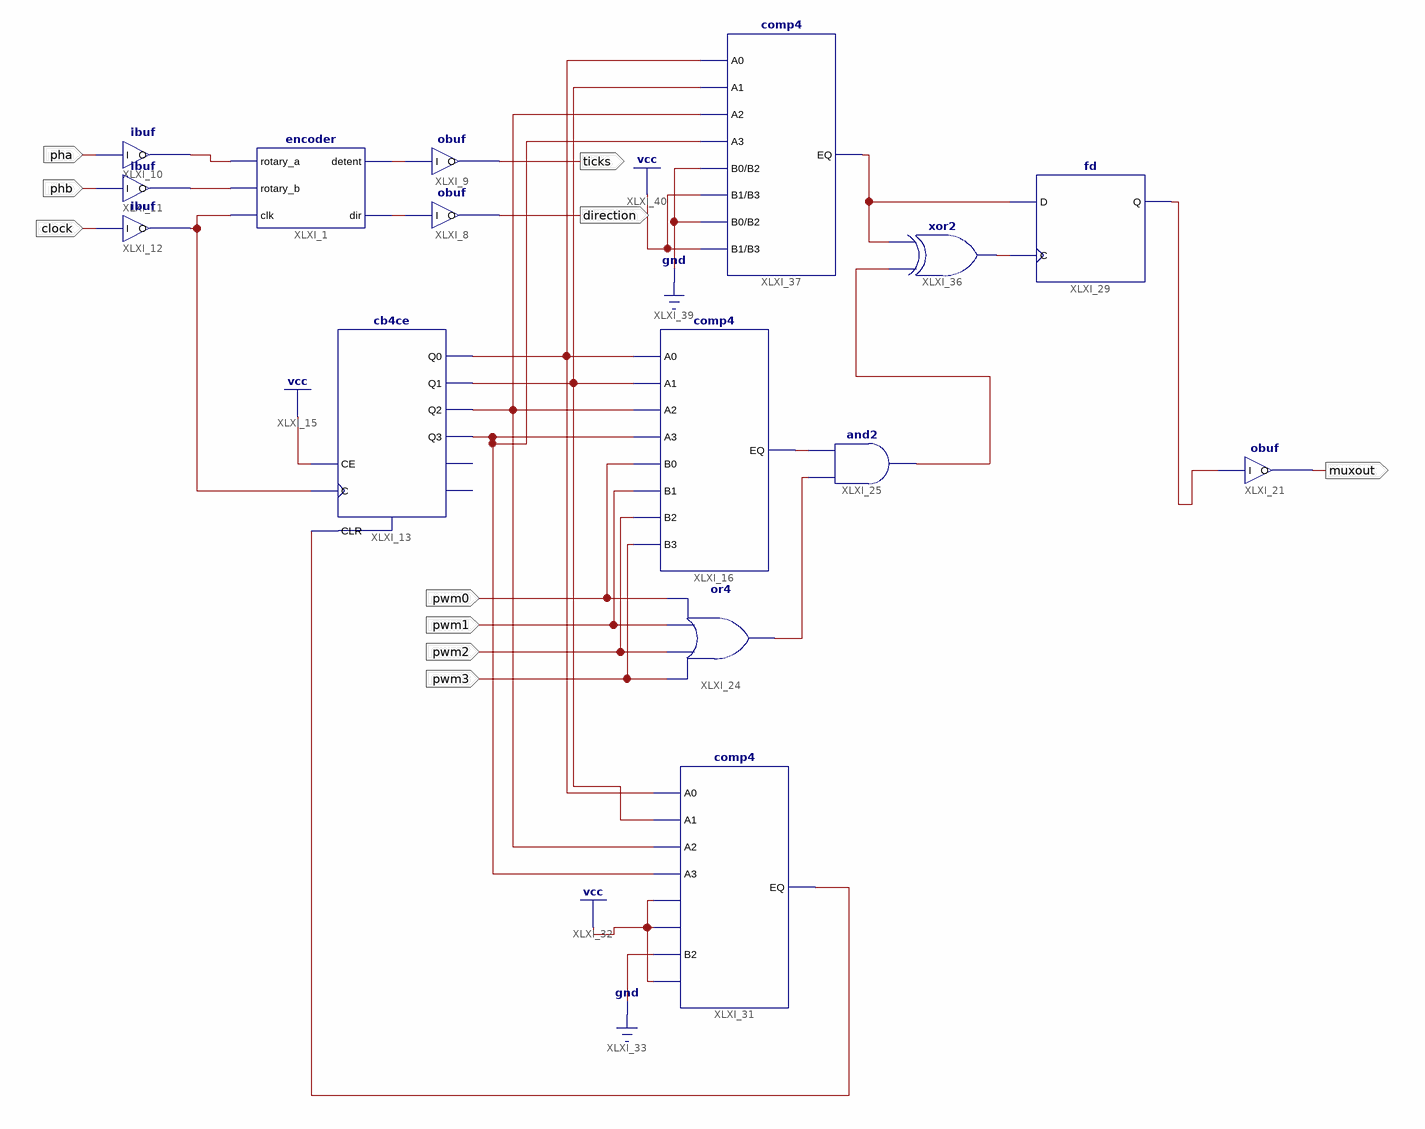
[diagram p0: schematic sheet 1]
// Xilinx ISE schematic TLD.sch (xc9500xl) as structural Verilog: 15 symbols, 10 ports
module TLD (
  input  pha,
  input  phb,
  input  clock,
  input  pwm3,
  input  pwm2,
  input  pwm1,
  input  pwm0,
  output ticks,
  output direction,
  output muxout
);

  wire XLXN_14, XLXN_15, XLXN_17, XLXN_18, XLXN_60, XLXN_61, XLXN_62, XLXN_72, XLXN_74, XLXN_83, XLXN_89,
       XLXN_93, XLXN_94, XLXN_95, XLXN_98, XLXN_99;

  encoder XLXI_1 (.rotary_a(XLXN_14), .rotary_b(XLXN_15), .clk(XLXN_72), .detent(XLXN_17), .dir(XLXN_18));
  obuf XLXI_8 (.I(XLXN_18), .O(direction));
  obuf XLXI_9 (.I(XLXN_17), .O(ticks));
  ibuf XLXI_10 (.I(pha), .O(XLXN_14));
  ibuf XLXI_11 (.I(phb), .O(XLXN_15));
  ibuf XLXI_12 (.I(clock), .O(XLXN_72));
  cb4ce XLXI_13 (
    .C(XLXN_72), .CE(1'b1), .CLR(XLXN_98), .Q0(XLXN_93), .Q1(XLXN_94), .Q2(XLXN_95), .Q3(XLXN_83));  // open: CEO, TC
  comp4 XLXI_16 (
    .A0(XLXN_93), .A1(XLXN_94), .A2(XLXN_95), .A3(XLXN_83), .B0(pwm0), .B1(pwm1), .B2(pwm2), .B3(pwm3),
    .EQ(XLXN_60));
  obuf XLXI_21 (.I(XLXN_62), .O(muxout));
  or XLXI_24 (XLXN_61, pwm3, pwm2, pwm1, pwm0);
  and XLXI_25 (XLXN_89, XLXN_61, XLXN_60);
  fd XLXI_29 (.C(XLXN_74), .D(XLXN_99), .Q(XLXN_62));
  comp4 XLXI_31 (
    .A0(XLXN_93), .A1(XLXN_94), .A2(XLXN_95), .A3(XLXN_83), .B0(1'b1), .B1(1'b1), .B2(1'b0), .B3(1'b1),
    .EQ(XLXN_98));
  xor XLXI_36 (XLXN_74, XLXN_89, XLXN_99);
  comp4 XLXI_37 (
    .A0(XLXN_93), .A1(XLXN_94), .A2(XLXN_95), .A3(XLXN_83), .B0(1'b0), .B1(1'b1), .B2(1'b0), .B3(1'b1),
    .EQ(XLXN_99));
endmodule
